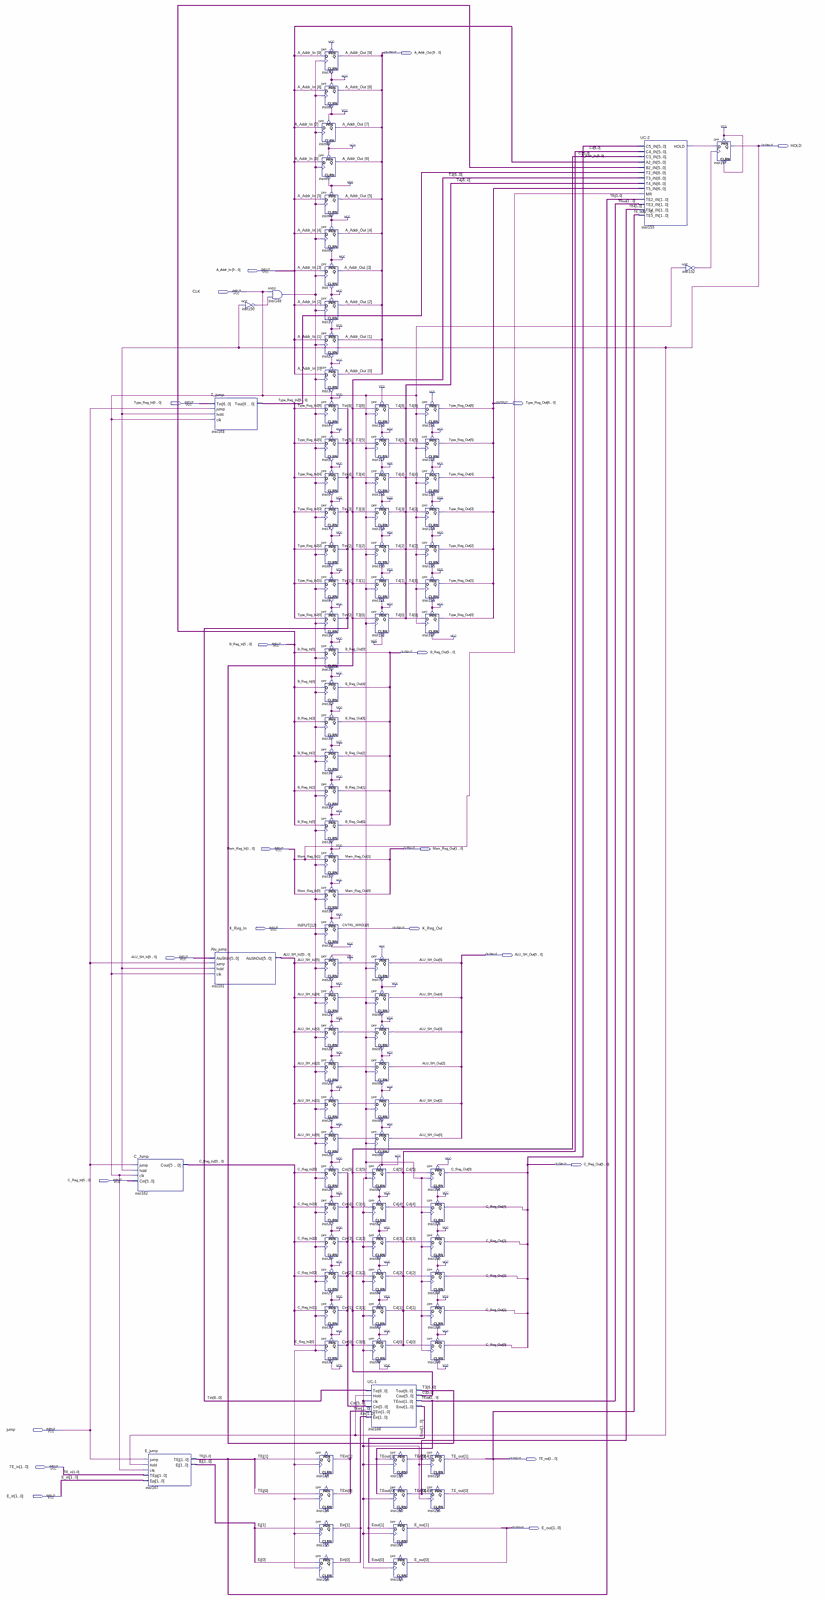
[diagram p0: schematic sheet, whole]
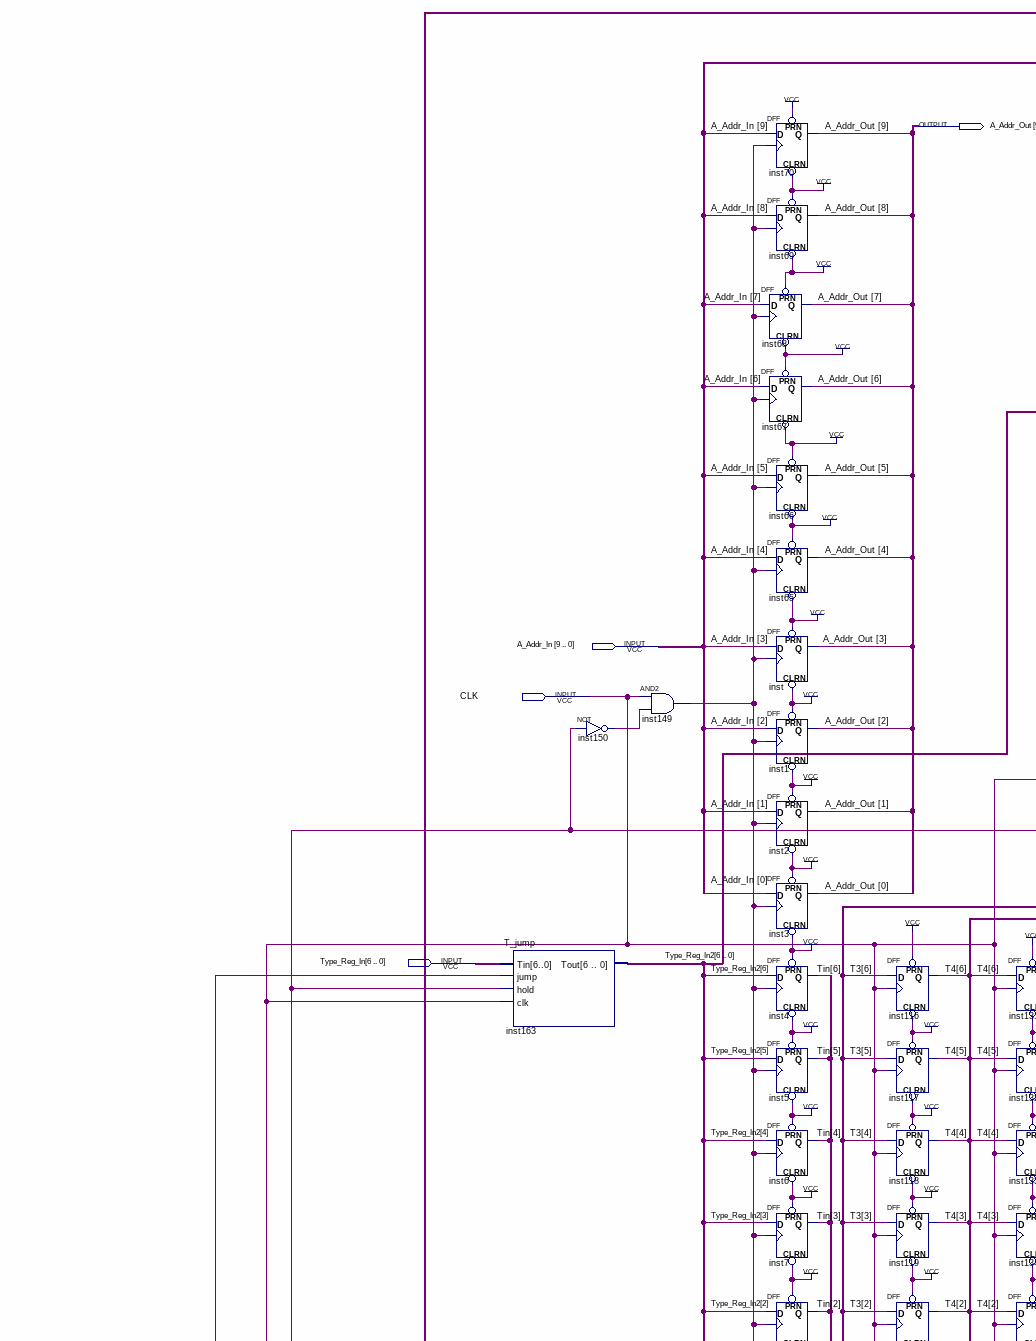
[diagram p1: schematic sheet, upper left part]
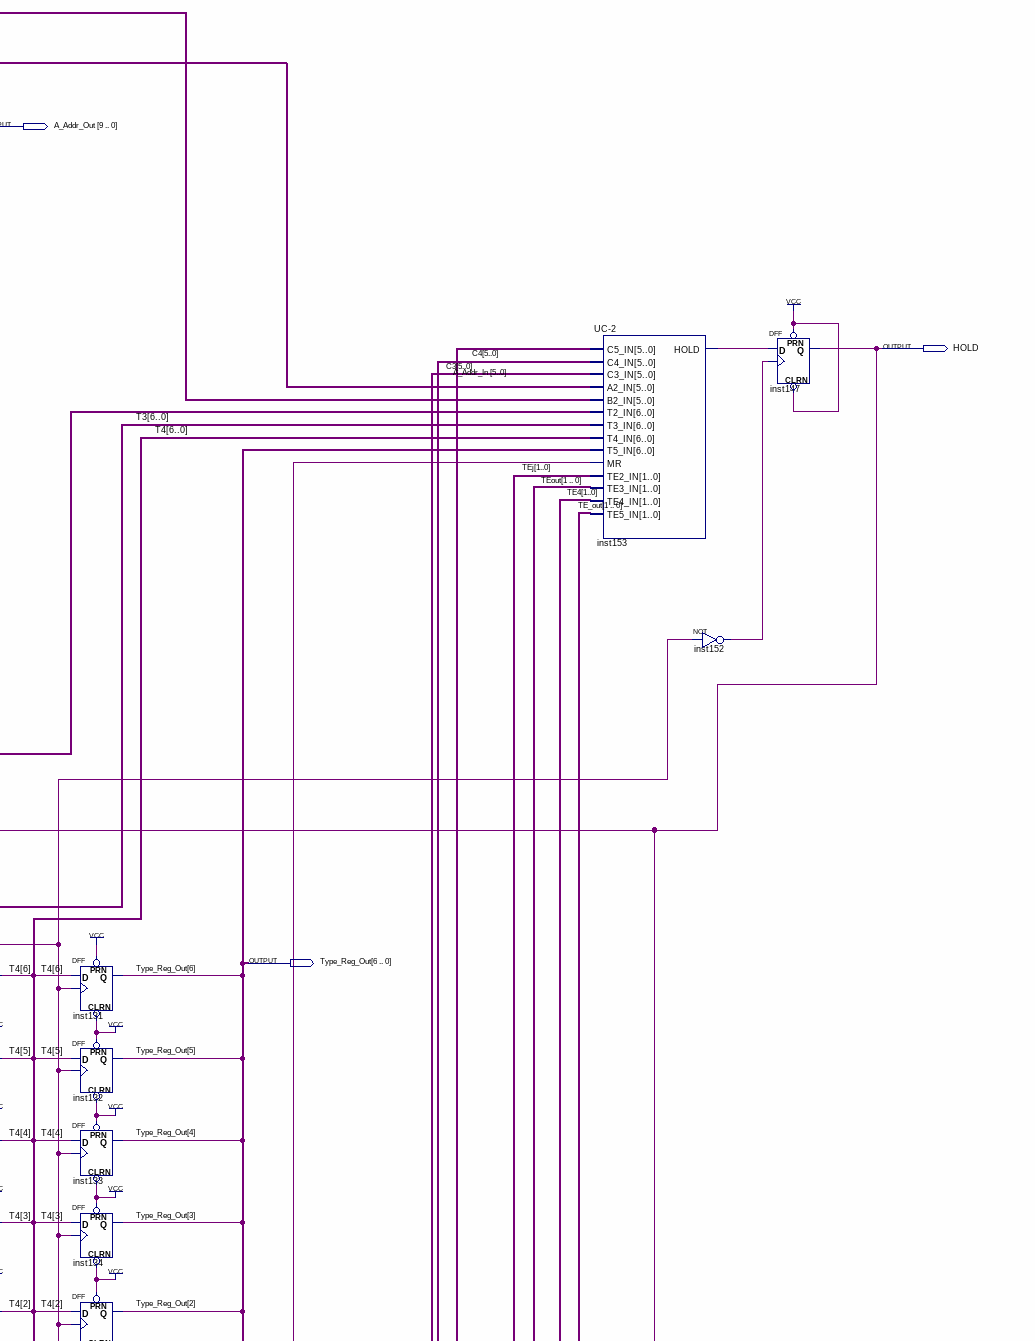
[diagram p2: schematic sheet, upper right part]
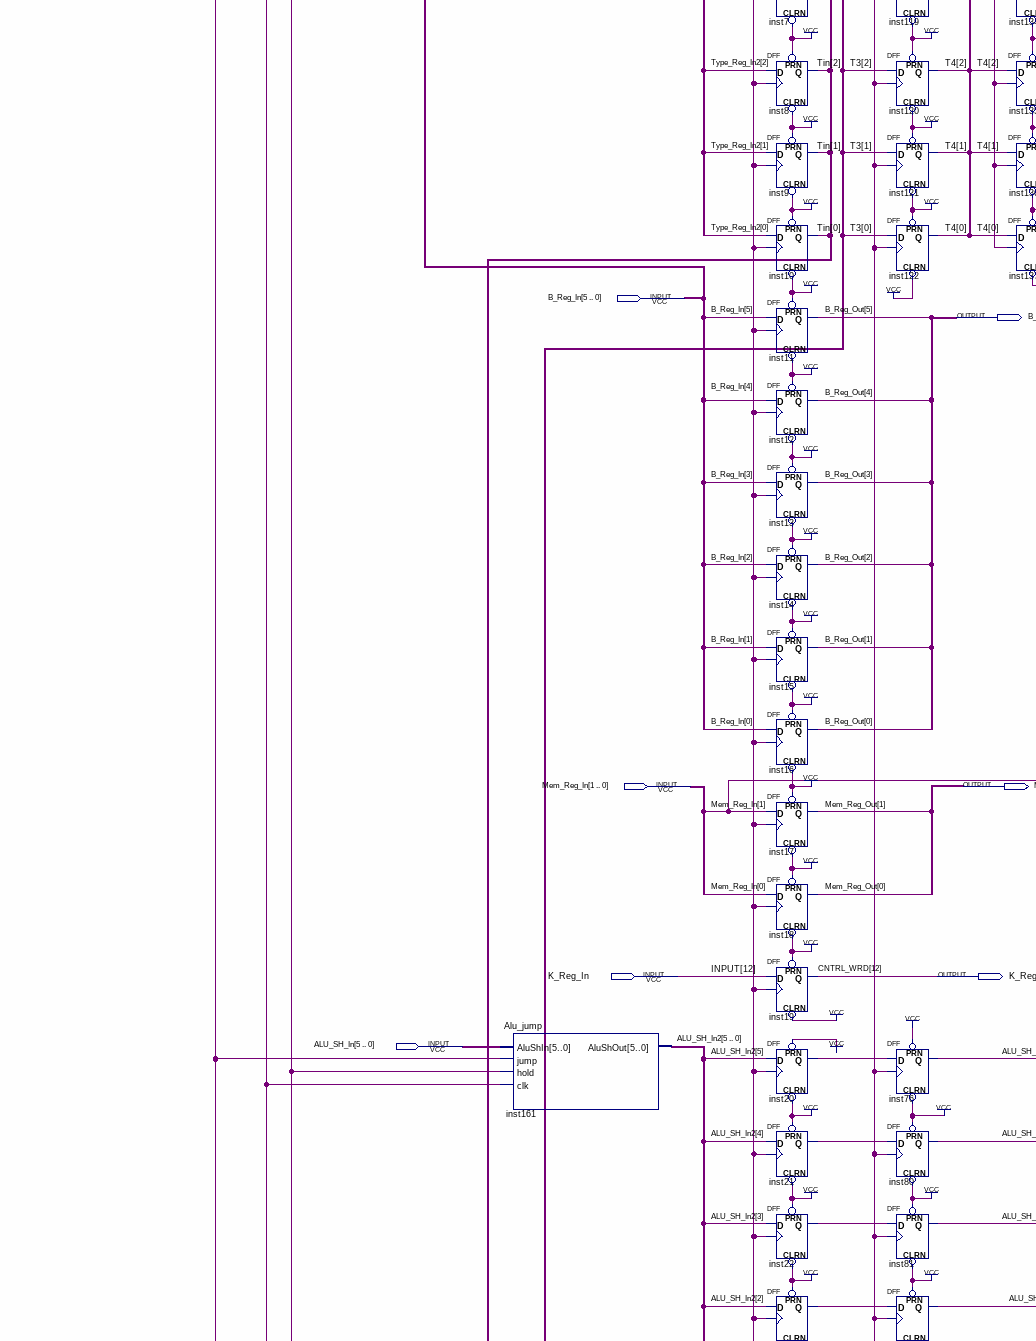
[diagram p3: schematic sheet, middle left part]
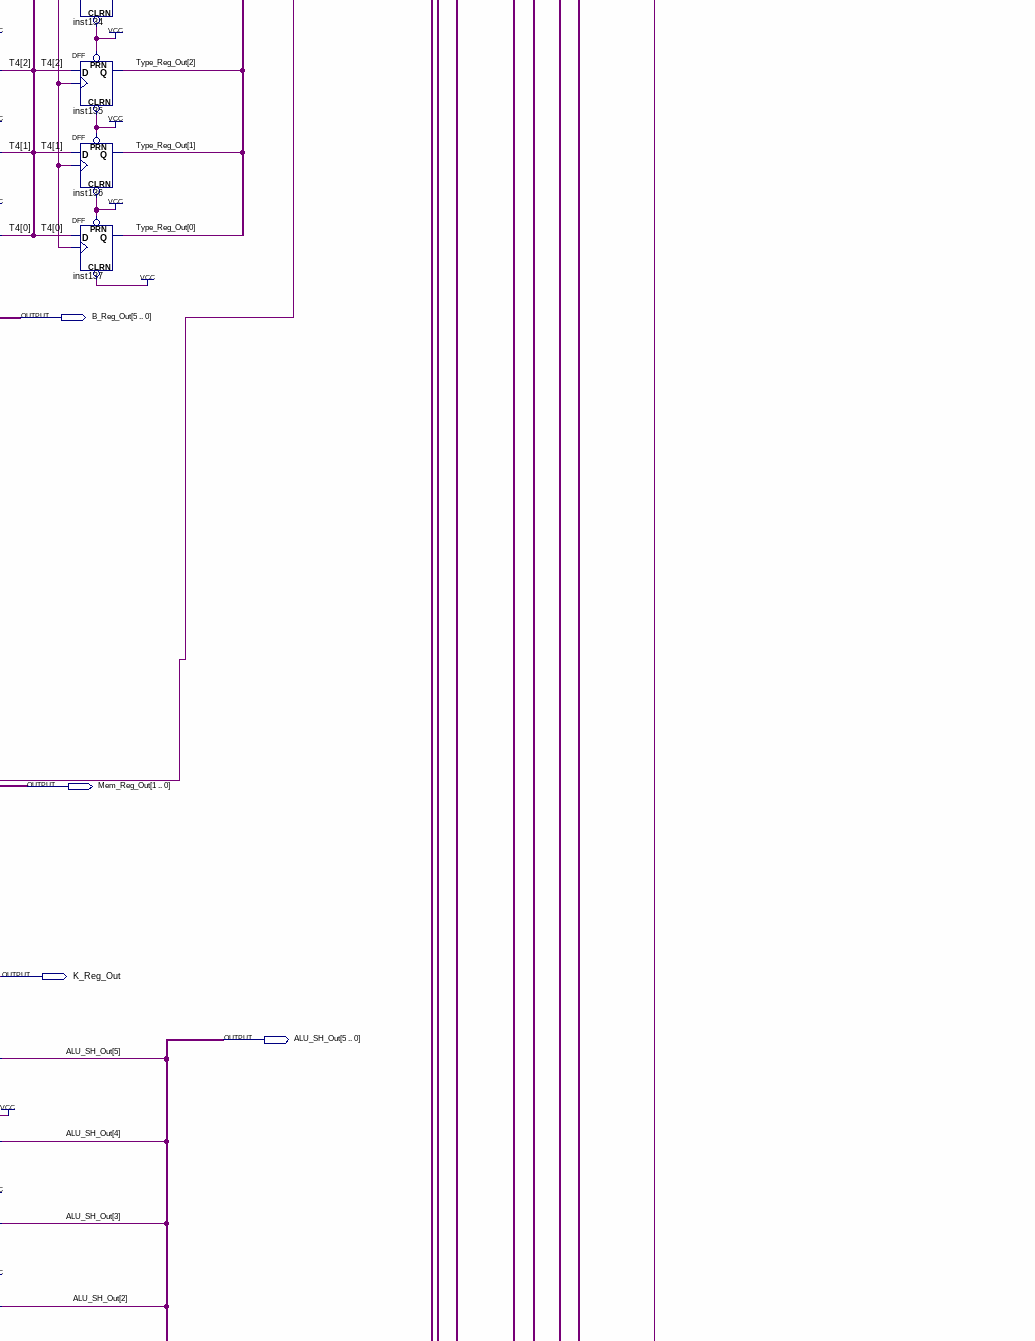
[diagram p4: schematic sheet, middle right part]
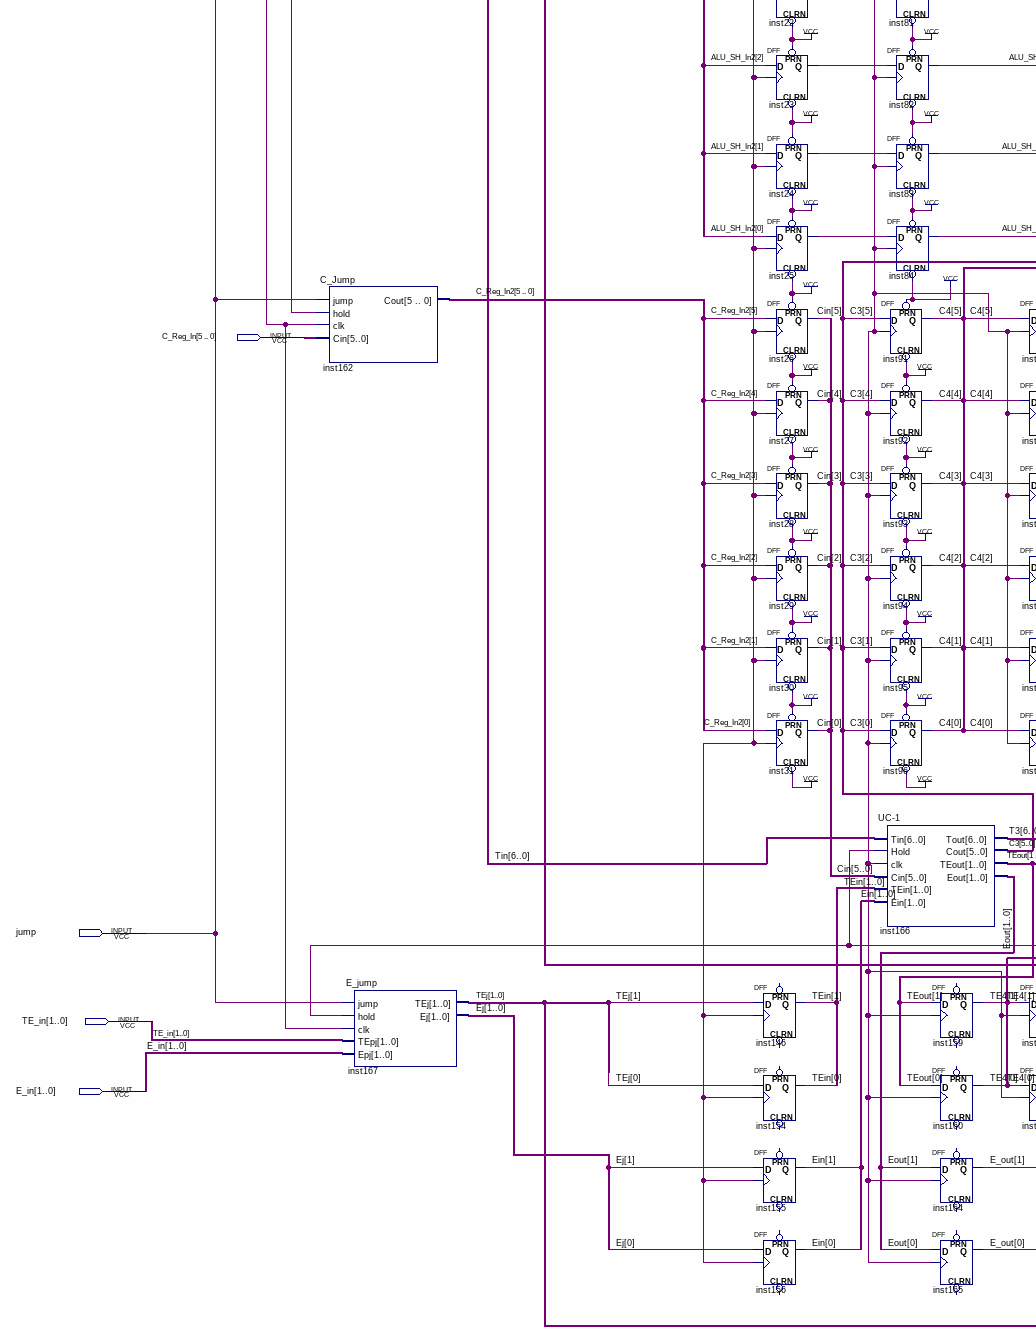
[diagram p5: schematic sheet, lower left part]
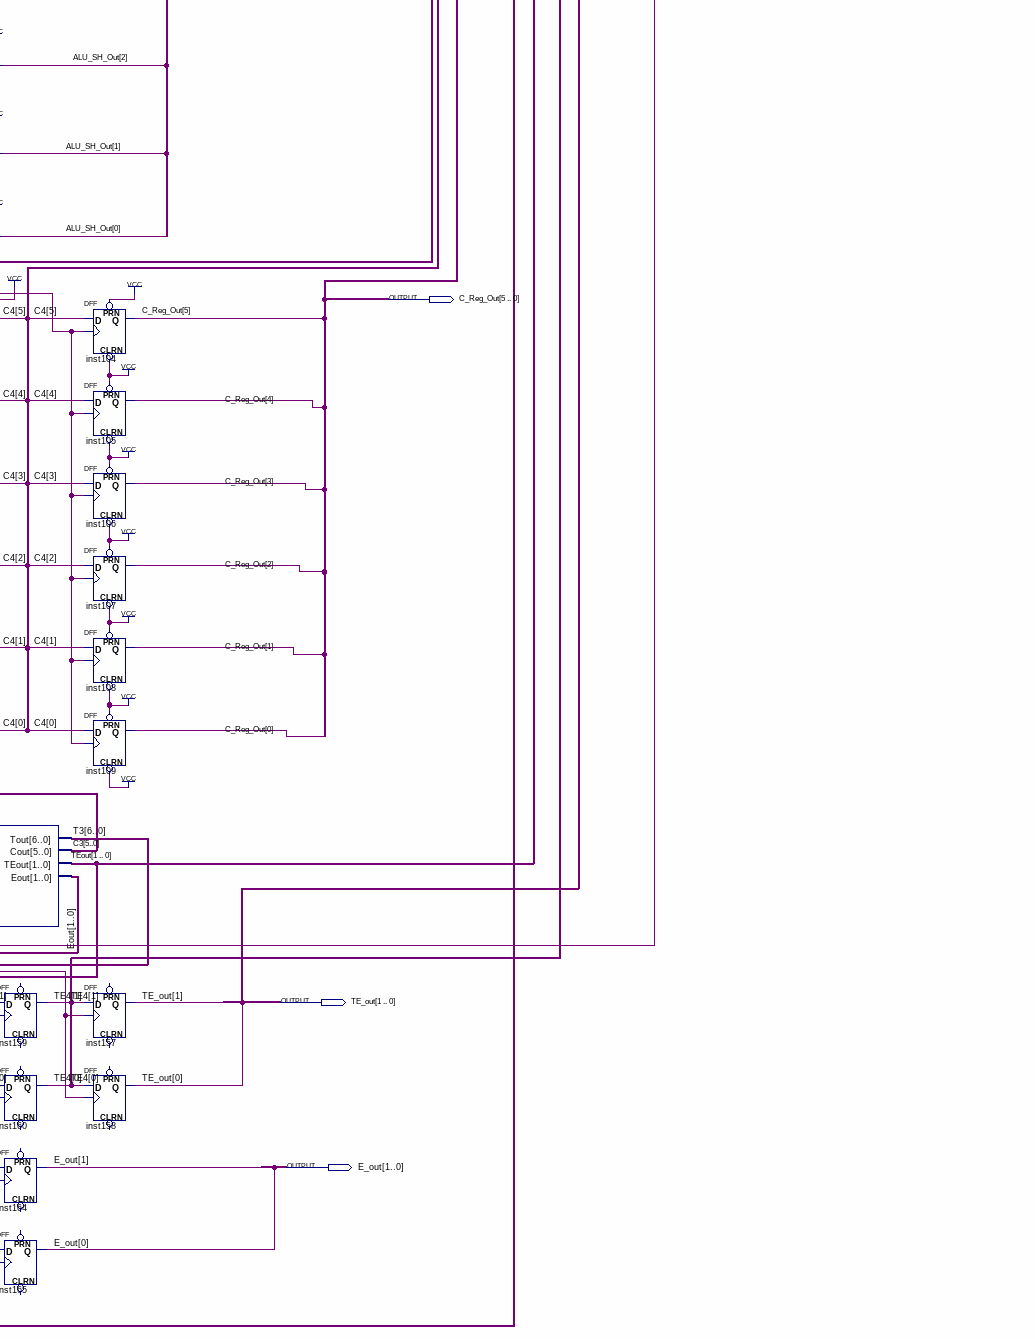
[diagram p6: schematic sheet, lower right part]
// Quartus schematic Control_Word_Register2.bdf as structural Verilog: 90 symbols, 21 pins
module Control_Word_Register2 (
  input  [9:0] A_Addr_In,
  input  CLK,
  input  [6:0] Type_Reg_In,
  input  [5:0] B_Reg_In,
  input  [1:0] Mem_Reg_In,
  input  K_Reg_In,
  input  [5:0] ALU_SH_In,
  input  [5:0] C_Reg_In,
  input  jump,
  input  [1:0] TE_in,
  input  [1:0] E_in,
  output [9:0] A_Addr_Out,
  output HOLD,
  output [6:0] Type_Reg_Out,
  output [5:0] B_Reg_Out,
  output [1:0] Mem_Reg_Out,
  output K_Reg_Out,
  output [5:0] ALU_SH_Out,
  output [5:0] C_Reg_Out,
  output [1:0] TE_out,
  output [1:0] E_out
);

  wire inst20_q, inst21_q, inst22_q, inst23_q, inst24_q, inst25_q, inst149_out, inst150_out, inst152_out,
       inst153_hold;
  wire [1:0] Ein, Ej, Eout, TE4, TEin, TEj, TEout;
  wire [5:0] ALU_SH_In2, C3, C4, C_Reg_In2, Cin;
  wire [6:0] T3, T4, Tin, Type_Reg_In2;

  C_Jump inst162 (.jump(jump), .hold(HOLD), .clk(CLK), .Cin(C_Reg_In), .Cout(C_Reg_In2));
  E_jump inst167 (.jump(jump), .hold(HOLD), .clk(CLK), .TEpj(TE_in), .Epj(E_in), .TEj(TEj), .Ej(Ej));
  T_jump inst163 (.Tin(Type_Reg_In), .jump(jump), .hold(HOLD), .clk(CLK), .Tout(Type_Reg_In2));
  Alu_jump inst161 (.AluShIn(ALU_SH_In), .jump(jump), .hold(HOLD), .clk(CLK), .AluShOut(ALU_SH_In2));
  not inst150 (inst150_out, HOLD);
  and inst149 (inst149_out, CLK, inst150_out);
  DFF inst70 (.CLRN(1'b1), .CLK(inst149_out), .D(A_Addr_In[9]), .PRN(1'b1), .Q(A_Addr_Out[9]));
  DFF inst69 (.CLRN(1'b1), .CLK(inst149_out), .D(A_Addr_In[8]), .PRN(1'b1), .Q(A_Addr_Out[8]));
  DFF inst68 (.CLRN(1'b1), .CLK(inst149_out), .D(A_Addr_In[7]), .PRN(1'b1), .Q(A_Addr_Out[7]));
  DFF inst67 (.CLRN(1'b1), .CLK(inst149_out), .D(A_Addr_In[6]), .PRN(1'b1), .Q(A_Addr_Out[6]));
  DFF inst66 (.CLRN(1'b1), .CLK(inst149_out), .D(A_Addr_In[5]), .PRN(1'b1), .Q(A_Addr_Out[5]));
  DFF inst65 (.CLRN(1'b1), .CLK(inst149_out), .D(A_Addr_In[4]), .PRN(1'b1), .Q(A_Addr_Out[4]));
  DFF inst (.CLRN(1'b1), .CLK(inst149_out), .D(A_Addr_In[3]), .PRN(1'b1), .Q(A_Addr_Out[3]));
  DFF inst1 (.CLRN(1'b1), .CLK(inst149_out), .D(A_Addr_In[2]), .PRN(1'b1), .Q(A_Addr_Out[2]));
  DFF inst2 (.CLRN(1'b1), .CLK(inst149_out), .D(A_Addr_In[1]), .PRN(1'b1), .Q(A_Addr_Out[1]));
  DFF inst3 (.CLRN(1'b1), .CLK(inst149_out), .D(A_Addr_In[0]), .PRN(1'b1), .Q(A_Addr_Out[0]));
  DFF inst4 (.CLRN(1'b1), .CLK(inst149_out), .D(Type_Reg_In2[6]), .PRN(1'b1), .Q(Tin[6]));
  DFF inst5 (.CLRN(1'b1), .CLK(inst149_out), .D(Type_Reg_In2[5]), .PRN(1'b1), .Q(Tin[5]));
  DFF inst6 (.CLRN(1'b1), .CLK(inst149_out), .D(Type_Reg_In2[4]), .PRN(1'b1), .Q(Tin[4]));
  DFF inst7 (.CLRN(1'b1), .CLK(inst149_out), .D(Type_Reg_In2[3]), .PRN(1'b1), .Q(Tin[3]));
  DFF inst8 (.CLRN(1'b1), .CLK(inst149_out), .D(Type_Reg_In2[2]), .PRN(1'b1), .Q(Tin[2]));
  DFF inst9 (.CLRN(1'b1), .CLK(inst149_out), .D(Type_Reg_In2[1]), .PRN(1'b1), .Q(Tin[1]));
  DFF inst10 (.CLRN(1'b1), .CLK(inst149_out), .D(Type_Reg_In2[0]), .PRN(1'b1), .Q(Tin[0]));
  DFF inst11 (.CLRN(1'b1), .CLK(inst149_out), .D(B_Reg_In[5]), .PRN(1'b1), .Q(B_Reg_Out[5]));
  DFF inst12 (.CLRN(1'b1), .CLK(inst149_out), .D(B_Reg_In[4]), .PRN(1'b1), .Q(B_Reg_Out[4]));
  DFF inst13 (.CLRN(1'b1), .CLK(inst149_out), .D(B_Reg_In[3]), .PRN(1'b1), .Q(B_Reg_Out[3]));
  DFF inst14 (.CLRN(1'b1), .CLK(inst149_out), .D(B_Reg_In[2]), .PRN(1'b1), .Q(B_Reg_Out[2]));
  DFF inst15 (.CLRN(1'b1), .CLK(inst149_out), .D(B_Reg_In[1]), .PRN(1'b1), .Q(B_Reg_Out[1]));
  DFF inst16 (.CLRN(1'b1), .CLK(inst149_out), .D(B_Reg_In[0]), .PRN(1'b1), .Q(B_Reg_Out[0]));
  DFF inst17 (.CLRN(1'b1), .CLK(inst149_out), .D(Mem_Reg_In[1]), .PRN(1'b1), .Q(Mem_Reg_Out[1]));
  DFF inst18 (.CLRN(1'b1), .CLK(inst149_out), .D(Mem_Reg_In[0]), .PRN(1'b1), .Q(Mem_Reg_Out[0]));
  DFF inst19 (.CLRN(1'b1), .CLK(inst149_out), .D(K_Reg_In), .PRN(1'b1), .Q(K_Reg_Out));
  DFF inst20 (.CLRN(1'b1), .CLK(inst149_out), .D(ALU_SH_In2[5]), .PRN(1'b1), .Q(inst20_q));
  DFF inst21 (.CLRN(1'b1), .CLK(inst149_out), .D(ALU_SH_In2[4]), .PRN(1'b1), .Q(inst21_q));
  DFF inst22 (.CLRN(1'b1), .CLK(inst149_out), .D(ALU_SH_In2[3]), .PRN(1'b1), .Q(inst22_q));
  DFF inst23 (.CLRN(1'b1), .CLK(inst149_out), .D(ALU_SH_In2[2]), .PRN(1'b1), .Q(inst23_q));
  DFF inst24 (.CLRN(1'b1), .CLK(inst149_out), .D(ALU_SH_In2[1]), .PRN(1'b1), .Q(inst24_q));
  DFF inst25 (.CLRN(1'b1), .CLK(inst149_out), .D(ALU_SH_In2[0]), .PRN(1'b1), .Q(inst25_q));
  DFF inst26 (.CLRN(1'b1), .CLK(inst149_out), .D(C_Reg_In2[5]), .PRN(1'b1), .Q(Cin[5]));
  DFF inst27 (.CLRN(1'b1), .CLK(inst149_out), .D(C_Reg_In2[4]), .PRN(1'b1), .Q(Cin[4]));
  DFF inst28 (.CLRN(1'b1), .CLK(inst149_out), .D(C_Reg_In2[3]), .PRN(1'b1), .Q(Cin[3]));
  DFF inst29 (.CLRN(1'b1), .CLK(inst149_out), .D(C_Reg_In2[2]), .PRN(1'b1), .Q(Cin[2]));
  DFF inst30 (.CLRN(1'b1), .CLK(inst149_out), .D(C_Reg_In2[1]), .PRN(1'b1), .Q(Cin[1]));
  DFF inst31 (.CLRN(1'b1), .CLK(inst149_out), .D(C_Reg_In2[0]), .PRN(1'b1), .Q(Cin[0]));
  DFF inst146 (.CLK(inst149_out), .D(TEj[1]), .Q(TEin[1]));  // open: CLRN, PRN
  DFF inst154 (.CLK(inst149_out), .D(TEj[0]), .Q(TEin[0]));  // open: CLRN, PRN
  DFF inst155 (.CLK(inst149_out), .D(Ej[1]), .Q(Ein[1]));  // open: CLRN, PRN
  DFF inst156 (.CLK(inst149_out), .D(Ej[0]), .Q(Ein[0]));  // open: CLRN, PRN
  DFF inst116 (.CLRN(1'b1), .CLK(CLK), .D(T3[6]), .PRN(1'b1), .Q(T4[6]));
  DFF inst117 (.CLRN(1'b1), .CLK(CLK), .D(T3[5]), .PRN(1'b1), .Q(T4[5]));
  DFF inst118 (.CLRN(1'b1), .CLK(CLK), .D(T3[4]), .PRN(1'b1), .Q(T4[4]));
  DFF inst119 (.CLRN(1'b1), .CLK(CLK), .D(T3[3]), .PRN(1'b1), .Q(T4[3]));
  DFF inst120 (.CLRN(1'b1), .CLK(CLK), .D(T3[2]), .PRN(1'b1), .Q(T4[2]));
  DFF inst121 (.CLRN(1'b1), .CLK(CLK), .D(T3[1]), .PRN(1'b1), .Q(T4[1]));
  DFF inst122 (.CLRN(1'b1), .CLK(CLK), .D(T3[0]), .PRN(1'b1), .Q(T4[0]));
  DFF inst76 (.CLRN(1'b1), .CLK(CLK), .D(inst20_q), .PRN(1'b1), .Q(ALU_SH_Out[5]));
  DFF inst80 (.CLRN(1'b1), .CLK(CLK), .D(inst21_q), .PRN(1'b1), .Q(ALU_SH_Out[4]));
  DFF inst81 (.CLRN(1'b1), .CLK(CLK), .D(inst22_q), .PRN(1'b1), .Q(ALU_SH_Out[3]));
  DFF inst82 (.CLRN(1'b1), .CLK(CLK), .D(inst23_q), .PRN(1'b1), .Q(ALU_SH_Out[2]));
  DFF inst83 (.CLRN(1'b1), .CLK(CLK), .D(inst24_q), .PRN(1'b1), .Q(ALU_SH_Out[1]));
  DFF inst84 (.CLRN(1'b1), .CLK(CLK), .D(inst25_q), .PRN(1'b1), .Q(ALU_SH_Out[0]));
  DFF inst91 (.CLRN(1'b1), .CLK(CLK), .D(C3[5]), .PRN(1'b1), .Q(C4[5]));
  DFF inst92 (.CLRN(1'b1), .CLK(CLK), .D(C3[4]), .PRN(1'b1), .Q(C4[4]));
  DFF inst93 (.CLRN(1'b1), .CLK(CLK), .D(C3[3]), .PRN(1'b1), .Q(C4[3]));
  DFF inst94 (.CLRN(1'b1), .CLK(CLK), .D(C3[2]), .PRN(1'b1), .Q(C4[2]));
  DFF inst95 (.CLRN(1'b1), .CLK(CLK), .D(C3[1]), .PRN(1'b1), .Q(C4[1]));
  DFF inst96 (.CLRN(1'b1), .CLK(CLK), .D(C3[0]), .PRN(1'b1), .Q(C4[0]));
  \UC-1  inst166 (
    .Tin(Tin), .Hold(HOLD), .clk(CLK), .Cin(Cin), .TEin(TEin), .Ein(Ein), .Tout(T3), .Cout(C3),
    .TEout(TEout), .Eout(Eout));
  DFF inst159 (.CLK(CLK), .D(TEout[1]), .Q(TE4[1]));  // open: CLRN, PRN
  DFF inst160 (.CLK(CLK), .D(TEout[0]), .Q(TE4[0]));  // open: CLRN, PRN
  DFF inst164 (.CLK(CLK), .D(Eout[1]), .Q(E_out[1]));  // open: CLRN, PRN
  DFF inst165 (.CLK(CLK), .D(Eout[0]), .Q(E_out[0]));  // open: CLRN, PRN
  DFF inst131 (.CLRN(1'b1), .CLK(CLK), .D(T4[6]), .PRN(1'b1), .Q(Type_Reg_Out[6]));
  DFF inst132 (.CLRN(1'b1), .CLK(CLK), .D(T4[5]), .PRN(1'b1), .Q(Type_Reg_Out[5]));
  DFF inst133 (.CLRN(1'b1), .CLK(CLK), .D(T4[4]), .PRN(1'b1), .Q(Type_Reg_Out[4]));
  DFF inst134 (.CLRN(1'b1), .CLK(CLK), .D(T4[3]), .PRN(1'b1), .Q(Type_Reg_Out[3]));
  DFF inst135 (.CLRN(1'b1), .CLK(CLK), .D(T4[2]), .PRN(1'b1), .Q(Type_Reg_Out[2]));
  DFF inst136 (.CLRN(1'b1), .CLK(CLK), .D(T4[1]), .PRN(1'b1), .Q(Type_Reg_Out[1]));
  DFF inst137 (.CLRN(1'b1), .CLK(CLK), .D(T4[0]), .PRN(1'b1), .Q(Type_Reg_Out[0]));
  DFF inst104 (.CLRN(1'b1), .CLK(CLK), .D(C4[5]), .PRN(1'b1), .Q(C_Reg_Out[5]));
  DFF inst105 (.CLRN(1'b1), .CLK(CLK), .D(C4[4]), .PRN(1'b1), .Q(C_Reg_Out[4]));
  DFF inst106 (.CLRN(1'b1), .CLK(CLK), .D(C4[3]), .PRN(1'b1), .Q(C_Reg_Out[3]));
  DFF inst107 (.CLRN(1'b1), .CLK(CLK), .D(C4[2]), .PRN(1'b1), .Q(C_Reg_Out[2]));
  DFF inst108 (.CLRN(1'b1), .CLK(CLK), .D(C4[1]), .PRN(1'b1), .Q(C_Reg_Out[1]));
  DFF inst109 (.CLRN(1'b1), .CLK(CLK), .D(C4[0]), .PRN(1'b1), .Q(C_Reg_Out[0]));
  DFF inst157 (.CLK(CLK), .D(TE4[1]), .Q(TE_out[1]));  // open: CLRN, PRN
  DFF inst158 (.CLK(CLK), .D(TE4[0]), .Q(TE_out[0]));  // open: CLRN, PRN
  \UC-2  inst153 (
    .C5_IN(C_Reg_Out), .C4_IN(C4), .C3_IN(C3), .A2_IN(A_Addr_In[5:0]), .B2_IN(B_Reg_In),
    .T2_IN(Type_Reg_In2), .T3_IN(T3), .T4_IN(T4), .T5_IN(Type_Reg_Out), .MR(Mem_Reg_In[1]), .TE2_IN(TEj),
    .TE3_IN(TEout), .TE4_IN(TE4), .TE5_IN(TE_out), .HOLD(inst153_hold));
  not inst152 (inst152_out, CLK);
  DFF inst147 (.CLRN(1'b1), .CLK(inst152_out), .D(inst153_hold), .PRN(1'b1), .Q(HOLD));

  // Other names for the same wires on the sheet: CNTRL_WRD[12] = K_Reg_Out; INPUT[12] = K_Reg_In
endmodule
